# Altium project NU-SYNTHS_MIDICV_CONN.PrjPcb
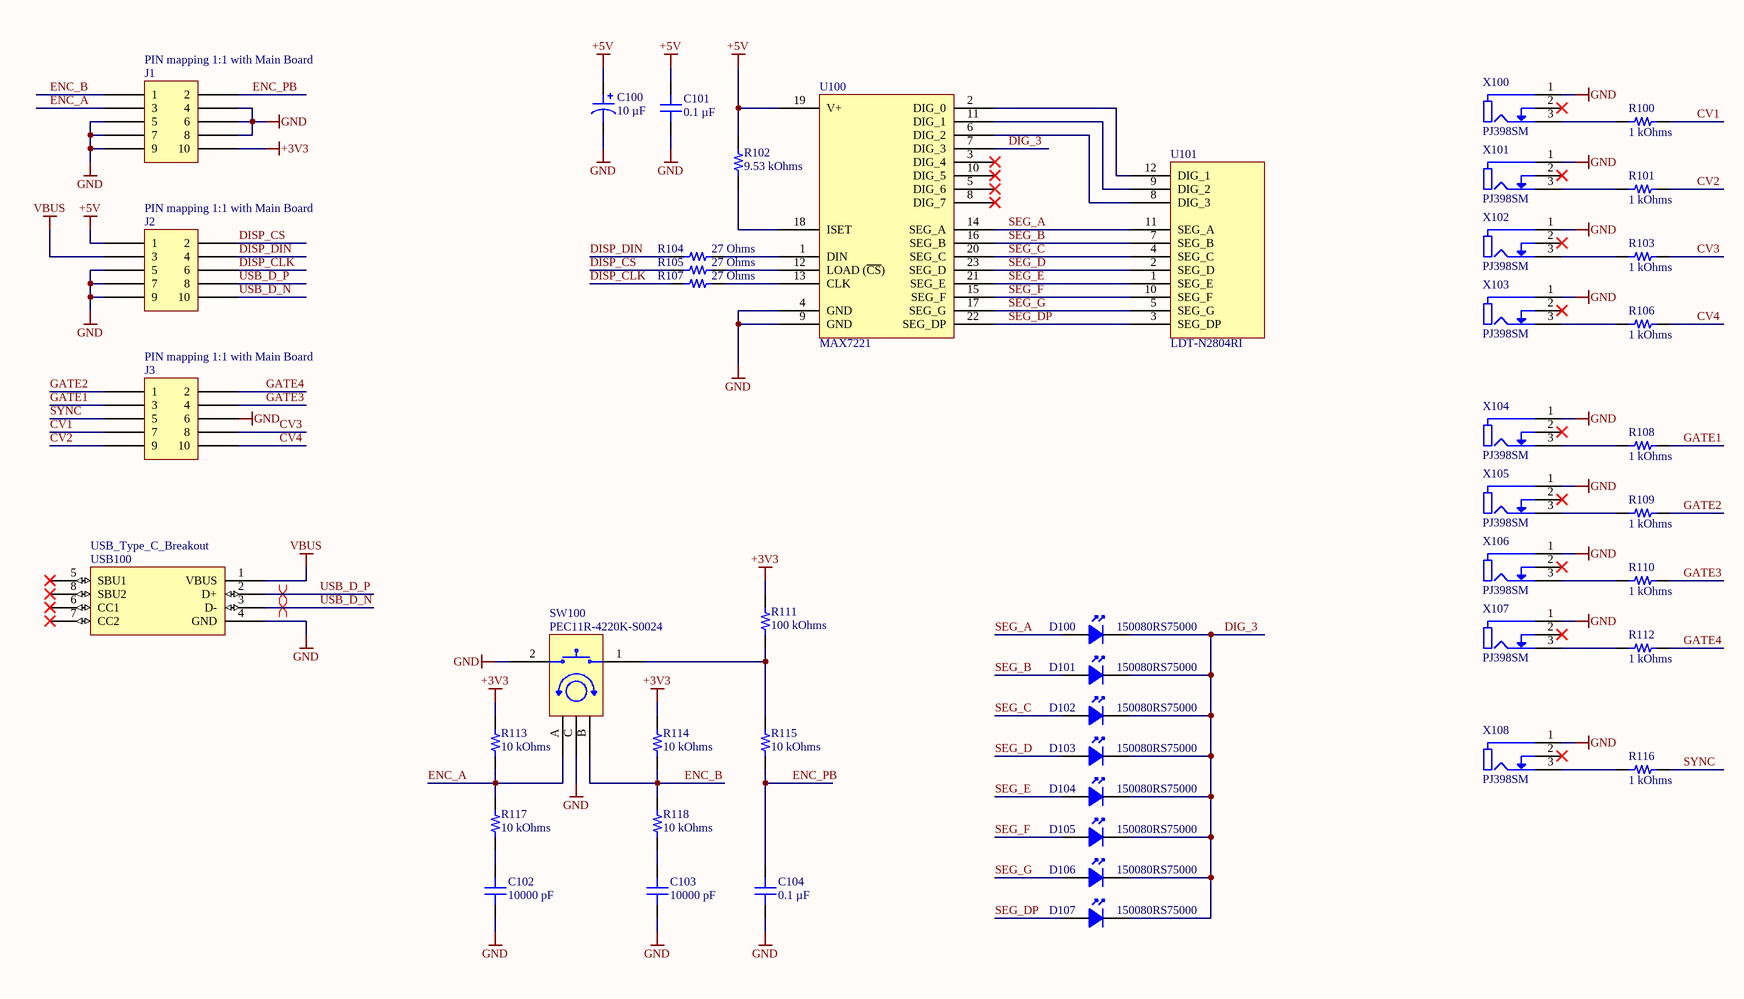
[diagram p0: NU-SYNTHS_MIDICV_CONN.SchDoc]
1 sheet, 48 parts. Net scope: global (net labels, ports and power ports of the same name join across sheets).
Board files: NU-SYNTHS_MIDICV_CONN_8HP.PcbDoc, NU-SYNTHS_MIDICV_PANEL_8HP.PcbDoc

## Sheet NU-SYNTHS_MIDICV_CONN.SchDoc
size A3; SheetNumber: 1; SheetTotal: 1

### Parts
C100  10 µF  [CAP ALSMD 4.3MM H5.4MM]
C101  0.1 µF  [CAP 0603_1608]
C102  10000 pF  [CAP 0603_1608]
C103  10000 pF  [CAP 0603_1608]
C104  0.1 µF  [CAP 0603_1608]
D100  150080RS75000  [LED0805_PIPE]
D101  150080RS75000  [LED0805_PIPE]
D102  150080RS75000  [LED0805_PIPE]
D103  150080RS75000  [LED0805_PIPE]
D104  150080RS75000  [LED0805_PIPE]
D105  150080RS75000  [LED0805_PIPE]
D106  150080RS75000  [LED0805_PIPE]
D107  150080RS75000  [LED0805_PIPE]
J1  GENERIC_HEADER_2x5  [HEADER_2x5_TH_MALE_MIRRORED]  (value not drawn)
J2  GENERIC_HEADER_2x5  [HEADER_2x5_TH_MALE_MIRRORED]  (value not drawn)
J3  GENERIC_HEADER_2x5  [HEADER_2x5_TH_MALE_MIRRORED]  (value not drawn)
R100  1 kOhms  [RES 0603_1608]
R101  1 kOhms  [RES 0603_1608]
R102  9.53 kOhms  [RES 0603_1608]
R103  1 kOhms  [RES 0603_1608]
R104  27 Ohms  [RES 0603_1608]
R105  27 Ohms  [RES 0603_1608]
R106  1 kOhms  [RES 0603_1608]
R107  27 Ohms  [RES 0603_1608]
R108  1 kOhms  [RES 0603_1608]
R109  1 kOhms  [RES 0603_1608]
R110  1 kOhms  [RES 0603_1608]
R111  100 kOhms  [RES 0603_1608]
R112  1 kOhms  [RES 0603_1608]
R113  10 kOhms  [RES 0603_1608]
R114  10 kOhms  [RES 0603_1608]
R115  10 kOhms  [RES 0603_1608]
R116  1 kOhms  [RES 0603_1608]
R117  10 kOhms  [RES 0603_1608]
R118  10 kOhms  [RES 0603_1608]
SW100  PEC11R-4220K-S0024  [PEC11R-4220K-S0024]
U100  MAX7221  [SOIC127P1032X265-24N]
U101  LDT-N2804RI  [LDT-N2804RI]
USB100  USB_Type_C_Breakout  [USBC_BREAKOUT_NO_TH]
X100  PJ398SM  [PJ398SM]
X101  PJ398SM  [PJ398SM]
X102  PJ398SM  [PJ398SM]
X103  PJ398SM  [PJ398SM]
X104  PJ398SM  [PJ398SM]
X105  PJ398SM  [PJ398SM]
X106  PJ398SM  [PJ398SM]
X107  PJ398SM  [PJ398SM]
X108  PJ398SM  [PJ398SM]

### Nets
+3V3: J1.10 R111.2 R113.2 R114.2
+5V: C100.1 C101.2 J2.1 R102.2 U100.19(V+)
GND: C100.2 C101.1 C102.1 C103.1 C104.1 J1.4 J1.5 J1.6 J1.7 J1.8 J1.9 J2.5 J2.7 J2.9 J3.6 SW100.2 SW100.C U100.4(GND) U100.9(GND) USB100.4(GND) X100.1(SLEEVE) X101.1(SLEEVE) X102.1(SLEEVE) X103.1(SLEEVE) X104.1(SLEEVE) X105.1(SLEEVE) X106.1(SLEEVE) X107.1(SLEEVE) X108.1(SLEEVE)
VBUS: J2.3 USB100.1(VBUS)
CV1: J3.7 R100.2
CV2: J3.9 R101.2
CV3: J3.8 R103.2
CV4: J3.10 R106.2
DIG_3: D100.1(K) D101.1(K) D102.1(K) D103.1(K) D104.1(K) D105.1(K) D106.1(K) D107.1(K) U100.7(DIG_3)
DISP_CLK: J2.6 R107.1
DISP_CS: J2.2 R105.1
DISP_DIN: J2.4 R104.1
ENC_A: J1.3 R113.1 R117.2 SW100.A
ENC_B: J1.1 R114.1 R118.2 SW100.B
ENC_PB: C104.2 J1.2 R115.1
GATE1: J3.3 R108.2
GATE2: J3.1 R109.2
GATE3: J3.4 R110.2
GATE4: J3.2 R112.2
SEG_A: D100.2(A) U100.14(SEG_A) U101.11(SEG_A)
SEG_B: D101.2(A) U100.16(SEG_B) U101.7(SEG_B)
SEG_C: D102.2(A) U100.20(SEG_C) U101.4(SEG_C)
SEG_D: D103.2(A) U100.23(SEG_D) U101.2(SEG_D)
SEG_DP: D107.2(A) U100.22(SEG_DP) U101.3(SEG_DP)
SEG_E: D104.2(A) U100.21(SEG_E) U101.1(SEG_E)
SEG_F: D105.2(A) U100.15(SEG_F) U101.10(SEG_F)
SEG_G: D106.2(A) U100.17(SEG_G) U101.5(SEG_G)
SYNC: J3.5 R116.2
USB_D_N: J2.10 USB100.3(D-)
USB_D_P: J2.8 USB100.2(D+)
NetC102_2: C102.2 R117.1
NetC103_2: C103.2 R118.1
NetR100_1: R100.1 X100.3(RING)
NetR101_1: R101.1 X101.3(RING)
NetR102_1: R102.1 U100.18(ISET)
NetR103_1: R103.1 X102.3(RING)
NetR104_2: R104.2 U100.1(DIN)
NetR105_2: R105.2 U100.12(LOAD_(~{CS}))
NetR106_1: R106.1 X103.3(RING)
NetR107_2: R107.2 U100.13(CLK)
NetR108_1: R108.1 X104.3(RING)
NetR109_1: R109.1 X105.3(RING)
NetR110_1: R110.1 X106.3(RING)
NetR111_1: R111.1 R115.2 SW100.1
NetR112_1: R112.1 X107.3(RING)
NetR116_1: R116.1 X108.3(RING)
NetU100_2: U100.2(DIG_0) U101.12(DIG_1)
NetU100_6: U100.6(DIG_2) U101.8(DIG_3)
NetU100_11: U100.11(DIG_1) U101.9(DIG_2)

Not connected (* = marked no-connect by the designer): U100 3(DIG_4)* 5(DIG_6)* 8(DIG_7)* 10(DIG_5)*; USB100 5(SBU1)* 6(CC1)* 7(CC2)* 8(SBU2)*; X100 2(TIP)*; X101 2(TIP)*; X102 2(TIP)*; X103 2(TIP)*; X104 2(TIP)*; X105 2(TIP)*; X106 2(TIP)*; X107 2(TIP)*; X108 2(TIP)*

### Layout directives
differential pair: USB_D_N, USB_D_P

### Notes on the sheet
- (near J1) PIN mapping 1:1 with Main Board
- (near J2) PIN mapping 1:1 with Main Board
- (near J3) PIN mapping 1:1 with Main Board

### Library data of the parts
C100 = UWX1C100MCL1GB: CAP ALUM 10UF 20% 16V SMD; manufacturer: Nichicon; Lifetime @ Temp.: 2000 Hrs @ 85°C; Polarization: Polar; Ripple Current @ High Frequency: 34.5 mA @ 10 kHz; Ripple Current @ Low Frequency: 23 mA @ 120 Hz; Surface Mount Land Size: 0.169" L x 0.169" W (4.30mm x 4.30mm); Part Number: UWX1C100MCL1GB; Applications: General Purpose; Capacitance: 10 µF; componentlink1description: Datasheet; componentlink1url: https://products.nichicon.co.jp/en/pdf/XJA043/e-uwx.pdf; componentlink2description: DigiKey Link; componentlink2url: https://www.digikey.com/en/products/detail/nichicon/UWX1C100MCL1GB/589841; Device Package: Radial, Can - SMD; Height - Seated (Max): 0.213" (5.40mm); lastupdated: 03/06/2024 19:53:00; Lifecycle Status: Active; Minimum Order: 1; Mounting Type: Surface Mount; Operating Temperature: -40°C ~ 85°C; Package / Case: Radial, Can - SMD; packaging: TapeAndReel; partid: 7030; Part Status: Active; price: 0.06; series: UWX; Size / Dimension: 0.157" Dia (4.00mm); Supplier 1: DigiKey; Supplier Part Number 1: 493-2100-1-ND; Tolerance: ±20%; value: 10 µF; Voltage - Rated: 16 V
C101 C104 = CC0603MRY5V8BB104: CAP CER 0.1UF 25V Y5V 0603; manufacturer: Yageo; Temperature Coefficient: Y5V (F); Tolerance: ±20%; Part Number: CC0603MRY5V8BB104; Value: 0.1 µF; Applications: General Purpose; Capacitance: 0.1 µF; componentlink1description: Datasheet; componentlink1url: http://www.yageo.com/documents/recent/UPY-GPHC_Y5V_6.3V-to-50V_8.pdf; componentlink2description: DigiKey Link; componentlink2url: https://www.digikey.com/en/products/detail/yageo/CC0603MRY5V8BB104/2103101; Device Package: 0603 (1608 Metric); lastupdated: 09/02/2024 20:10:27; Lifecycle Status: Active; Minimum Order: 1; Mounting Type: Surface Mount, MLCC; Operating Temperature: -30°C ~ 85°C; Package / Case: 0603 (1608 Metric); packaging: TapeAndReel; partid: 5132; Part Status: Active; price: 0.01; series: CC; Size / Dimension: 0.063" L x 0.031" W (1.60mm x 0.80mm); Supplier 1: DigiKey; Supplier Part Number 1: 311-1363-1-ND; Thickness (Max): 0.035" (0.90mm); Voltage - Rated: 25V
C102 C103 = CC0603KRX7R9BB103: CAP CER 10000PF 50V X7R 0603; manufacturer: Yageo; Tolerance: ±10%; Part Number: CC0603KRX7R9BB103; Value: 10000 pF; Applications: General Purpose; Capacitance: 10000 pF; componentlink1description: Datasheet; componentlink1url: https://www.yageo.com/upload/media/product/productsearch/datasheet/mlcc/UPY-GPHC_X7R_6.3V-to-50V_18.pdf; componentlink2description: DigiKey Link; componentlink2url: https://www.digikey.com/en/products/detail/yageo/CC0603KRX7R9BB103/302819; Device Package: 0603 (1608 Metric); lastupdated: 09/02/2024 20:10:06; Lifecycle Status: Active; Minimum Order: 1; Mounting Type: Surface Mount, MLCC; Operating Temperature: -55°C ~ 125°C; Package / Case: 0603 (1608 Metric); packaging: TapeAndReel; partid: 17848; Part Status: Active; price: 0.01; series: CC; Size / Dimension: 0.063" L x 0.031" W (1.60mm x 0.80mm); Supplier 1: DigiKey; Supplier Part Number 1: 311-1085-1-ND; Temperature Coefficient: X7R; Thickness (Max): 0.035" (0.90mm); Voltage - Rated: 50V
D100-D107 = 150080RS75000: Standard LEDs - SMD WL-SMCW SMDMono TpVw Waterclr 0805 Red
J1-J3 = GENERIC_HEADER_2x5: Generic 2x5 header; Supplier 1: Farnell; Supplier Part Number 1: 2396199
R100 R101 R103 R106 R108-R110 R112 R116 = CRCW06031K00FKEAC: RES 1K OHM 1% 1/10W 0603; Manufacturer: Vishay Dale; Power (Watts): 0.1W, 1/10W; Temperature Coefficient: ±100ppm/°C; Part Number: CRCW06031K00FKEAC; Value: 1 kOhms; ComponentLink1Description: Datasheet; ComponentLink1URL: http://www.vishay.com/docs/28773/crcwce3.pdf; ComponentLink2Description: DigiKey Link; ComponentLink2URL: https://www.digikey.com/en/products/detail/vishay-dale/CRCW06031K00FKEAC/7928371; Composition: Thick Film; Device Package: 0603 (1608 Metric); Height - Seated (Max): 0.022" (0.55mm); LastUpdated: 09/02/2024 20:43:06; Lifecycle Status: Active; Minimum Order: 1; Number of Terminations: 2; Operating Temperature: -55°C ~ 155°C; Package / Case: 0603 (1608 Metric); Packaging: CutTape; PartId: 12551; Part Status: Active; Price: 0.01; Resistance: 1 kOhms; Series: CRCW-C; Supplier 1: DigiKey; Supplier Part Number 1: 541-3949-1-ND; Supplier Device Package: 0603; Tolerance: ±1%
R102 = CRCW06039K53FKEA: RES SMD 9.53K OHM 1% 1/10W 0603; Manufacturer: Vishay Dale; Power (Watts): 0.1W, 1/10W; Temperature Coefficient: ±100ppm/°C; Part Number: CRCW06039K53FKEA; Value: 9.53 kOhms; ComponentLink1Description: Datasheet; ComponentLink1URL: http://www.vishay.com/docs/20035/dcrcwe3.pdf; ComponentLink2Description: DigiKey Link; ComponentLink2URL: https://www.digikey.com/en/products/detail/vishay-dale/CRCW06039K53FKEA/1174780; Composition: Thick Film; Device Package: 0603 (1608 Metric); Features: Automotive AEC-Q200; Height - Seated (Max): 0.020" (0.50mm); LastUpdated: 09/02/2024 20:42:37; Lifecycle Status: Active; Minimum Order: 1; Number of Terminations: 2; Operating Temperature: -55°C ~ 155°C; Package / Case: 0603 (1608 Metric); Packaging: TapeAndReel; PartId: 20117; Part Status: Active; Price: 0.01; Ratings: AEC-Q200; Resistance: 9.53 kOhms; Series: CRCW; Size / Dimension: 0.061" L x 0.033" W (1.55mm x 0.85mm); Supplier 1: DigiKey; Supplier Part Number 1: 541-9.53KHCT-ND; Supplier Device Package: 0603; Tolerance: ±1%
R104 R105 R107 = CRCW060327R0FKEA: RES SMD 27 OHM 1% 1/10W 0603; Manufacturer: Vishay Dale; Power (Watts): 0.1W, 1/10W; Temperature Coefficient: ±100ppm/°C; Part Number: CRCW060327R0FKEA; Value: 27 Ohms; ComponentLink1Description: Datasheet; ComponentLink1URL: http://www.vishay.com/docs/20035/dcrcwe3.pdf; ComponentLink2Description: DigiKey Link; ComponentLink2URL: https://www.digikey.com/en/products/detail/vishay-dale/CRCW060327R0FKEA/1174487; Composition: Thick Film; Device Package: 0603 (1608 Metric); Features: Automotive AEC-Q200; Height - Seated (Max): 0.020" (0.50mm); LastUpdated: 09/02/2024 20:43:24; Lifecycle Status: Active; Minimum Order: 1; Number of Terminations: 2; Operating Temperature: -55°C ~ 155°C; Package / Case: 0603 (1608 Metric); Packaging: TapeAndReel; PartId: 8035; Part Status: Active; Price: 0.01; Ratings: AEC-Q200; Resistance: 27 Ohms; Series: CRCW; Size / Dimension: 0.061" L x 0.033" W (1.55mm x 0.85mm); Supplier 1: DigiKey; Supplier Part Number 1: 541-27.0HCT-ND; Supplier Device Package: 0603; Tolerance: ±1%
R111 = CRCW0603100KFKEAC: RES 100K OHM 1% 1/10W 0603; Manufacturer: Vishay Dale; Power (Watts): 0.1W, 1/10W; Temperature Coefficient: ±100ppm/°C; Part Number: CRCW0603100KFKEAC; Value: 100 kOhms; ComponentLink1Description: Datasheet; ComponentLink1URL: http://www.vishay.com/docs/28773/crcwce3.pdf; ComponentLink2Description: DigiKey Link; ComponentLink2URL: https://www.digikey.com/en/products/detail/vishay-dale/CRCW0603100KFKEAC/7928372; Composition: Thick Film; Device Package: 0603 (1608 Metric); Height - Seated (Max): 0.022" (0.55mm); LastUpdated: 09/02/2024 20:43:06; Lifecycle Status: Active; Minimum Order: 1; Number of Terminations: 2; Operating Temperature: -55°C ~ 155°C; Package / Case: 0603 (1608 Metric); Packaging: CutTape; PartId: 12549; Part Status: Active; Price: 0.01; Resistance: 100 kOhms; Series: CRCW-C; Supplier 1: DigiKey; Supplier Part Number 1: 541-3950-1-ND; Supplier Device Package: 0603; Tolerance: ±1%
R113-R115 R117 R118 = CRCW060310K0FKTA: RES SMD 10K OHM 1% 1/10W 0603; Manufacturer: Vishay Dale; Power (Watts): 0.1W, 1/10W; Temperature Coefficient: ±100ppm/°C; Part Number: CRCW060310K0FKTA; Value: 10 kOhms; ComponentLink1Description: Datasheet; ComponentLink1URL: http://www.vishay.com/docs/20008/dcrcw.pdf; ComponentLink2Description: DigiKey Link; ComponentLink2URL: https://www.digikey.com/en/products/detail/vishay-dale/CRCW060310K0FKTA/1221625; Composition: Thick Film; Device Package: 0603 (1608 Metric); Features: Automotive AEC-Q200; Height - Seated (Max): 0.020" (0.50mm); LastUpdated: 12/07/2023 19:33:59; Lifecycle Status: Active; Minimum Order: 1; Number of Terminations: 2; Operating Temperature: -55°C ~ 155°C; Package / Case: 0603 (1608 Metric); Packaging: TapeAndReel; PartId: 9687; Part Status: Active; Price: 0.01; Ratings: AEC-Q200; Resistance: 10 kOhms; Series: CRCW; Size / Dimension: 0.063" L x 0.033" W (1.60mm x 0.85mm); Supplier 1: DigiKey; Supplier Part Number 1: 541-2980-1-ND; Supplier Device Package: 0603; Tolerance: ±1%
SW100 = PEC11R-4220K-S0024: Encoders 20mm SHAFT w/SWITCH; Supplier 1: Digi-Key; Supplier 2: Digi-Key; Supplier 3: Digi-Key; Supplier 4: Digi-Key; Supplier 5: Digi-Key; Supplier 6: Newark; Supplier 7: Digi-Key; Supplier 8: Digi-Key; Supplier 9: Newark; Supplier 10: Digi-Key; Supplier 11: Digi-Key; Supplier Part Number 1: PEC11R-4220K-S0024-ND; Supplier Part Number 2: PEC12R-4117F-S0012-ND; Supplier Part Number 3: PEC12R-4017F-N0024-ND; Supplier Part Number 4: PEC12R-4025F-S0024-ND; Supplier Part Number 5: PEC11R-4220F-S0024-ND; Supplier Part Number 6: 53W9488; Supplier Part Number 7: PEC11R-4215K-S0024-ND; Supplier Part Number 8: PEC11R-4225F-S0024-ND; Supplier Part Number 9: 53W9583; Supplier Part Number 10: PEC12R-4125F-S0012-ND; Supplier Part Number 11: PEC12R-4220F-S0024-ND
U100 = MAX7221: LED Driver, 4V to 5.5V input, 8 Outputs, 10 MHz Switch. Frequency, 4.5V/320 mA out, SOIC-24; Supplier 1: RSComponents; Supplier Part Number 1: 1897548
U101 = LDT-N2804RI: Common Cathode, 3 Digit 7 Segment Display, 0.28''; Supplier 1: Digi-Key; Supplier Part Number 1: 67-2308-ND
USB100 = USBC_Breakout: USB type C Breakout Board
X100-X108 = PJ398SM: Vertical mount 3.5mm switching mono jack.